# Altium schematic sheet power.SchDoc
size A4
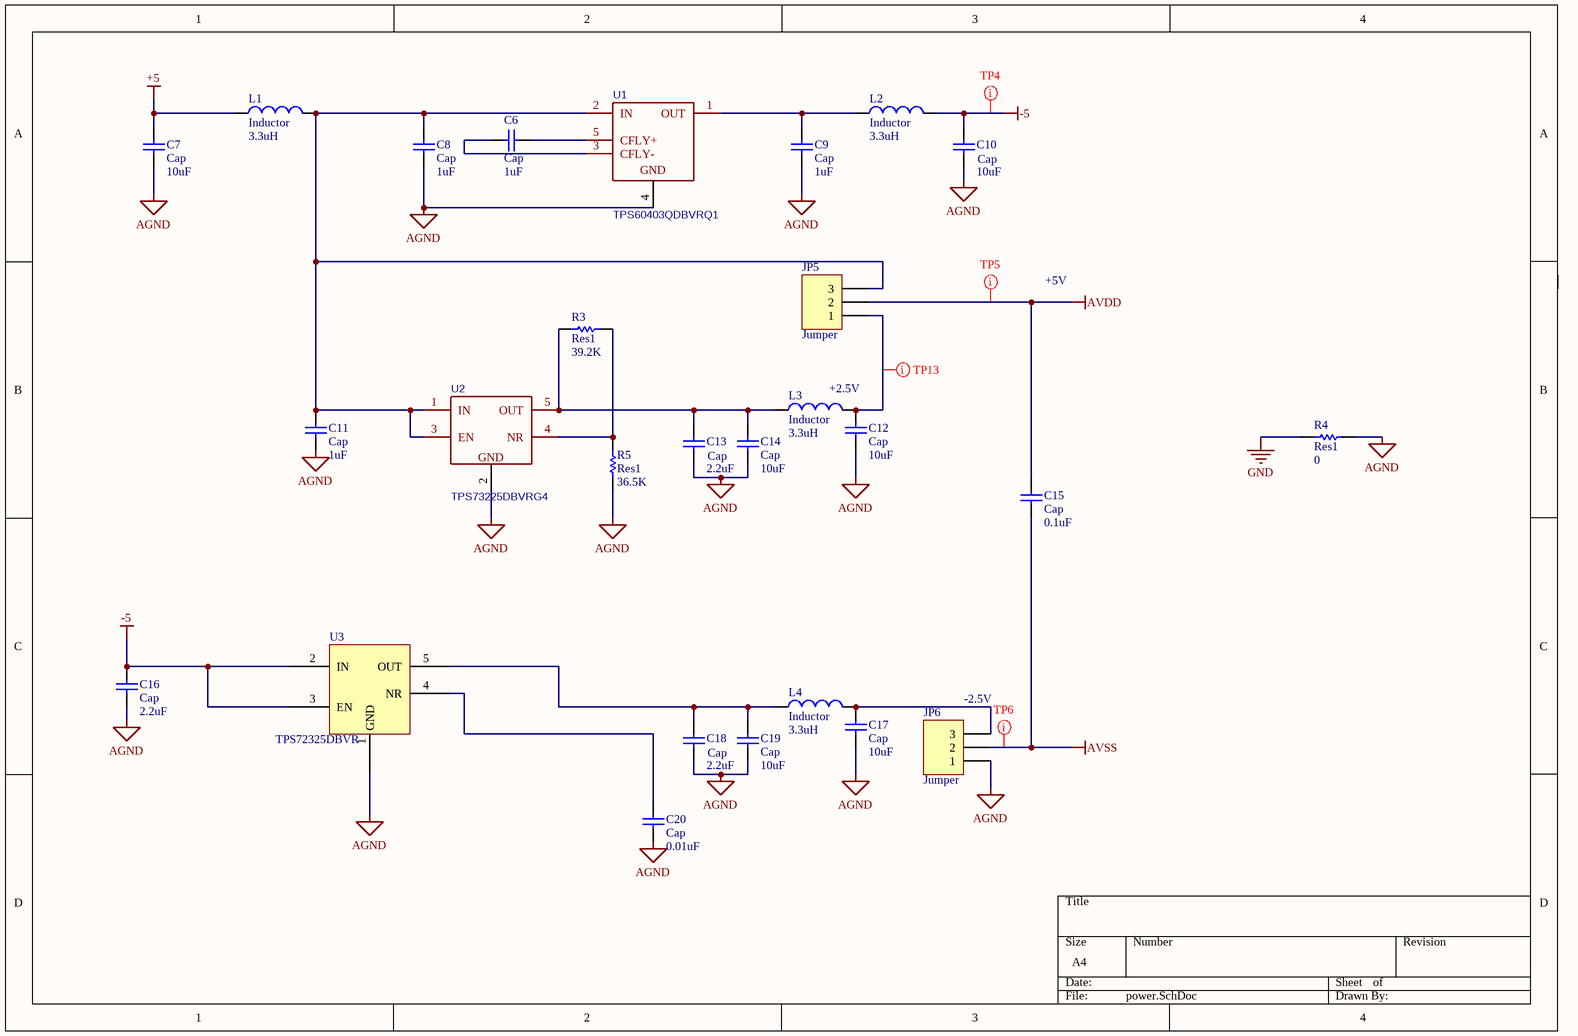
[diagram p0: power.SchDoc]

## Parts
C6  Cap  value 1uF  [1608[0603]]
C7  Cap  value 10uF  [6-0805_N]
C8  Cap  value 1uF  [1608[0603]]
C9  Cap  value 1uF  [1608[0603]]
C10  Cap  value 10uF  [6-0805_N]
C11  Cap  value 1uF  [1608[0603]]
C12  Cap  value 10uF  [6-0805_N]
C13  Cap  value 2.2uF  [1608[0603]]
C14  Cap  value 10uF  [6-0805_N]
C15  Cap  value 0.1uF  [1608[0603]]
C16  Cap  value 2.2uF  [1608[0603]]
C17  Cap  value 10uF  [6-0805_N]
C18  Cap  value 2.2uF  [1608[0603]]
C19  Cap  value 10uF  [6-0805_N]
C20  Cap  value 0.01uF  [1608[0603]]
JP5  Jumper  [HDR1X3]
JP6  Jumper  [HDR1X3]
L1  Inductor  value 3.3uH  [6-0805_M]
L2  Inductor  value 3.3uH  [6-0805_M]
L3  Inductor  value 3.3uH  [6-0805_M]
L4  Inductor  value 3.3uH  [6-0805_M]
R3  Res1  value 39.2K  [1608[0603]]
R4  Res1  value 0  [1608[0603]]
R5  Res1  value 36.5K  [1608[0603]]
U1  TPS60403QDBVRQ1  [DBV5]
U2  TPS73225DBVRG4  [SOT23-5]
U3  TPS72325DBVR  [DBV0005A]

## Nets
+5: C7.2 L1.1
-5: C10.2 C16.2 L2.2 U3.2(IN) U3.3(EN)
AGND: C7.1 C8.1 C9.1 C10.1 C11.1 C12.1 C13.1 C14.1 C16.1 C17.1 C18.1 C19.1 C20.1 JP6.1 R4.1 R5.1 U1.4(GND) U2.2(GND) U3.1(GND)
AVDD: C15.2 JP5.2
AVSS: C15.1 JP6.2
GND: R4.2
NetC6_1: C6.1 U1.5(CFLY+)
NetC6_2: C6.2 U1.3(CFLY-)
NetC8_2: C8.2 C11.2 JP5.3 L1.2 U1.2(IN) U2.1(IN) U2.3(EN)
NetC9_2: C9.2 L2.1 U1.1(OUT)
NetC12_2: C12.2 JP5.1 L3.2
NetC13_2: C13.2 C14.2 L3.1 R3.1 U2.5(OUT)
NetC17_2: C17.2 JP6.3 L4.2
NetC18_2: C18.2 C19.2 L4.1 U3.5(OUT)
NetC20_2: C20.2 U3.4(NR)
NetR3_2: R3.2 R5.2 U2.4(NR)

## Layout directives
mark named TP4: -5
mark named TP5: AVDD
mark named TP6: AVSS
mark named TP13: NetC12_2

## Notes on the sheet
- +5V
- (near L3) +2.5V
- (near JP6) -2.5V

## Library data of the parts
C6-C20 = Cap: Capacitor; Published: 8-Jun-2000; LatestRevisionDate: 17-Jul-2002; LatestRevisionNote: Re-released for DXP Platform.; PackageReference: RAD-0.3; Publisher: Altium Limited; PackageDescription: Radial Cap, Thru-Hole; 2 Leads; 0.3 in Pin Spacing
JP5 JP6 = Header 3: Header, 3-Pin; LatestRevisionDate: 17-Jul-2002; LatestRevisionNote: Re-released for DXP Platform.; Publisher: Altium Limited
L1-L4 = Inductor: Code_IEC: 1005; Published: 8-Jun-2000; LatestRevisionDate: 29-May-2009; LatestRevisionNote: IPC-7351 Footprint Added.; PackageReference: 0402-A; Publisher: Altium Limited; PackageDescription: Chip Inductor; Code_JEITA: 0402
R3-R5 = Res1: Resistor; Published: 8-Jun-2000; LatestRevisionDate: 17-Jul-2002; LatestRevisionNote: Re-released for DXP Platform.; PackageReference: AXIAL-0.3; Publisher: Altium Limited; PackageDescription: Axial Device, Thru-Hole; 2 Leads; 0.3 in Pin Spacing
U1 = TPS60403QDBVRQ1: BOM_Manufacturer: TI; Contributor: LCSC; SMT Type: Extend; BOM_Supplier: LCSC; BOM_Manufacturer Part: TPS60403QDBVRQ1; BOM_Supplier Part: C130215; BOM_LCSC Assembly: Yes; spicePre: U; spiceSymbolName: TPS60403QDBVRQ1
U2 = TPS73225DBVRG4: spicePre: U; spiceSymbolName: TPS73225DBVRG4